# Altium schematic sheet PSU.SchDoc
size A3; SheetNumber: 5; SheetTotal: 6
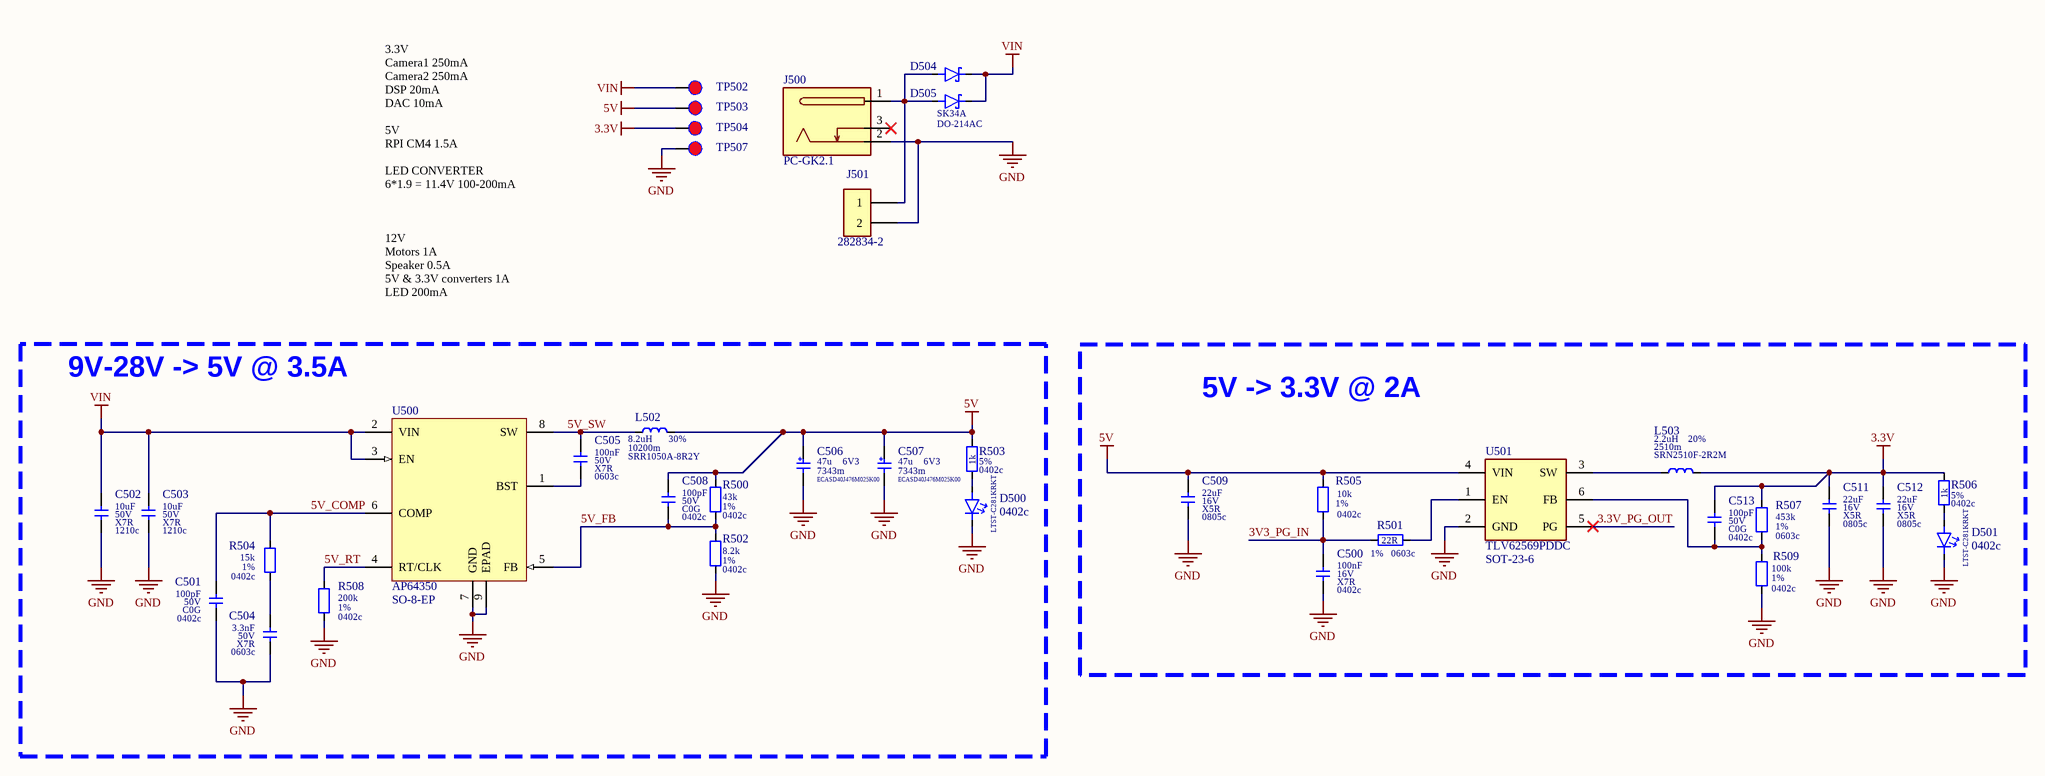
[diagram p0: PSU.SchDoc]

## Parts
C500  11 Parameter 4: X7R  07 Package: 0402c  08 Parameter 1: 100nF  09 Parameter 2: 16V  [CAPC1005X60L]  (hidden comment: CL05B104KO5NNNC)
C501  11 Parameter 4: C0G  07 Package: 0402c  08 Parameter 1: 100pF  09 Parameter 2: 50V  [CAPC1005X60L]  (hidden comment: GRM1555C1H101JA01D)
C502  11 Parameter 4: X7R  07 Package: 1210c  08 Parameter 1: 10uF  09 Parameter 2: 50V  [CAPC3225X270L]  (hidden comment: CL32B106KBJNNNE)
C503  11 Parameter 4: X7R  07 Package: 1210c  08 Parameter 1: 10uF  09 Parameter 2: 50V  [CAPC3225X270L]  (hidden comment: CL32B106KBJNNNE)
C504  11 Parameter 4: X7R  07 Package: 0603c  08 Parameter 1: 3.3nF  09 Parameter 2: 50V  [CAPC1608X90L]  (hidden comment: CL10B332KB8NNNC)
C505  11 Parameter 4: X7R  07 Package: 0603c  08 Parameter 1: 100nF  09 Parameter 2: 50V  [CAPC1608X90L]  (hidden comment: CL10B104KB8NNNC)
C506  09 Parameter 2: 6V3  08 Parameter 1: 47u  07 Package: 7343m  [CAPMP7343X20L]  (hidden comment: ECASD40J476M025K00)
C507  09 Parameter 2: 6V3  08 Parameter 1: 47u  07 Package: 7343m  [CAPMP7343X20L]  (hidden comment: ECASD40J476M025K00)
C508  11 Parameter 4: C0G  07 Package: 0402c  08 Parameter 1: 100pF  09 Parameter 2: 50V  [CAPC1005X60L]  (hidden comment: GRM1555C1H101JA01D)
C509  11 Parameter 4: X5R  07 Package: 0805c  08 Parameter 1: 22uF  09 Parameter 2: 16V  [CAPC2013X145L]  (hidden comment: CL21A226MOQNNNE)
C511  11 Parameter 4: X5R  07 Package: 0805c  08 Parameter 1: 22uF  09 Parameter 2: 16V  [CAPC2013X145L]  (hidden comment: CL21A226MOQNNNE)
C512  11 Parameter 4: X5R  07 Package: 0805c  08 Parameter 1: 22uF  09 Parameter 2: 16V  [CAPC2013X145L]  (hidden comment: CL21A226MOQNNNE)
C513  11 Parameter 4: C0G  07 Package: 0402c  08 Parameter 1: 100pF  09 Parameter 2: 50V  [CAPC1005X60L]  (hidden comment: GRM1555C1H101JA01D)
D500  07 Package: 0402c  [LEDSC100x50x35-2L]  (hidden comment: LTST-C281KRKT)
D501  07 Package: 0402c  [LEDSC100x50x35-2L]  (hidden comment: LTST-C281KRKT)
D504  SK34A  [DIOM4326X250L]  (value not drawn)
D505  07 Package: DO-214AC  [DIOM4326X250L]  (hidden comment: SK34A)
J500  PC-GK2.1  [NINIGI PC-GK2.1]
J501  282834-2  [TE 282834-2]
L502  09 Parameter 2: 30%  08 Parameter 1: 8.2uH  07 Package: 10200m  [IND102100X51L]  (hidden comment: SRR1050A-8R2Y)
L503  09 Parameter 2: 20%  08 Parameter 1: 2.2uH  07 Package: 2510m  [IND2510X10L]  (hidden comment: SRN2510F-2R2M)
R500  07 Package: 0402c  09 Parameter 2: 1%  08 Parameter 1: 43k  [RESC1005X40L]  (hidden comment: RC0402FR-0743KL)
R501  07 Package: 0603c  09 Parameter 2: 1%  08 Parameter 1: 22R  [RESC1608X55L]  (hidden comment: RC0603FR-0722RL)
R502  07 Package: 0402c  09 Parameter 2: 1%  08 Parameter 1: 8.2k  [RESC1005X40L]  (hidden comment: RC0402FR-078K2L)
R503  07 Package: 0402c  09 Parameter 2: 5%  08 Parameter 1: 1k  [RESC1005X40L]  (hidden comment: RC0402JR-071KL)
R504  07 Package: 0402c  09 Parameter 2: 1%  08 Parameter 1: 15k  [RESC1005X40L]  (hidden comment: RC0402FR-0715KL)
R505  07 Package: 0402c  09 Parameter 2: 1%  08 Parameter 1: 10k  [RESC1005X40L]  (hidden comment: RC0402FR-0710KL)
R506  07 Package: 0402c  09 Parameter 2: 5%  08 Parameter 1: 1k  [RESC1005X40L]  (hidden comment: RC0402JR-071KL)
R507  07 Package: 0603c  09 Parameter 2: 1%  08 Parameter 1: 453k  [RESC1608X55L]  (hidden comment: RC0603FR-07453KL)
R508  07 Package: 0402c  09 Parameter 2: 1%  08 Parameter 1: 200k  [RESC1005X40L]  (hidden comment: RC0402FR-07200KL)
R509  07 Package: 0402c  09 Parameter 2: 1%  08 Parameter 1: 100k  [RESC1005X40L]  (hidden comment: RC0402FR-07100KL)
TP502  TESTPAD  [TP 1.2mm]  (value not drawn)  (no BOM)
TP503  TESTPAD  [TP 1.2mm]  (value not drawn)  (no BOM)
TP504  TESTPAD  [TP 1.2mm]  (value not drawn)  (no BOM)
TP507  TESTPAD  [TP 1.2mm]  (value not drawn)  (no BOM)
U500  07 Package: SO-8-EP  [SOIC127P600X170_HS350x261-9L]  (hidden comment: AP64350)
U501  07 Package: SOT-23-6  [SOT95P280X110-6L]  (hidden comment: TLV62569PDDC)

## Blocks framed on the sheet
9V-28V -> 5V @ 3.5A: C501-C508 D500 L502 R500 R502-R504 R508 U500
5V -> 3.3V @ 2A: C500 C509 C511-C513 D501 L503 R501 R505-R507 R509 U501

## Nets
3.3V: C511.2 C512.2 C513.2 L503.2 R506.2 R507.2 TP504.1
5V: C506.1 C507.1 C508.2 C509.2 L502.2 R500.2 R503.2 R505.2 TP503.1 U501.4(VIN)
GND: C500.1 C501.1 C502.1 C503.1 C504.1 C506.2 C507.2 C509.1 C511.1 C512.1 D500.K D501.K J500.2 J501.2 R502.1 R508.1 R509.1 TP507.1 U500.7(GND) U500.9(EPAD) U501.2(GND)
VIN: C502.2 C503.2 D504.K D505.K TP502.1 U500.2(VIN) U500.3(EN)
3.3V_PG_OUT: U501.5(PG)
3V3_PG_IN: C500.2 R501.1 R505.1
5V_COMP: C501.2 R504.2 U500.6(COMP)
5V_FB: C508.1 R500.1 R502.2 U500.5(FB)
5V_RT: R508.2 U500.4(RT/CLK)
5V_SW: C505.2 L502.1 U500.8(SW)
NetC504_2: C504.2 R504.1
NetC505_1: C505.1 U500.1(BST)
NetC513_1: C513.1 R507.1 R509.2 U501.6(FB)
NetD500_A: D500.A R503.1
NetD501_A: D501.A R506.1
NetD504_A: D504.A D505.A J500.1 J501.1
NetL503_1: L503.1 U501.3(SW)
NetR501_2: R501.2 U501.1(EN)

Not connected (* = marked no-connect by the designer): J500 3*

## Notes on the sheet
- 3.3V
  Camera1 250mA
  Camera2 250mA
  DSP 20mA
  DAC 10mA
  5V
  RPI CM4 1.5A
  LED CONVERTER
  6*1.9 = 11.4V 100-200mA
  12V
  Motors 1A
  Speaker 0.5A
  5V & 3.3V converters 1A
  LED 200mA
- Version:
- SVN Rev:
- Sheet:
- File:
- Modification Date:
- Variant:
- of
- Sheet Size:
- A3
- SaraAI
- (in symbol 260) +

## Library data of the parts
C500 = 138: SMT 0402c 100nF 16V 10% X7R 25.8MHz 125'C; 03 Manufacturer: Samsung; 00 Index: 138; 01 Name: CAPACITOR CERAMIC CL05B104KO5NNNC Samsung; 05 Sub Group: CERAMIC; 04 Main Group: CAPACITOR; 06 Assembly: SMT; 12 Parameter 5: 25.8MHz; 13 Parameter 6: 125'C; 14 Modification Date: 16.11.2020; ComponentLink1Description: DATASHEET; ComponentLink1URL: E:\Praca\Mindsailors\Mindsailors Altium\Database Library\Datasheets\CAPACITOR\Samsung CL05B104KO5NNNC.pdf; 02 MPN: CL05B104KO5NNNC; 10 Parameter 3: 10%
C501 C508 C513 = 137: SMT 0402c 100pF 50V 5% C0G 814MHz 125'C; 03 Manufacturer: Murata; 00 Index: 137; 01 Name: CAPACITOR CERAMIC GRM1555C1H101JA01D Murata; 05 Sub Group: CERAMIC; 04 Main Group: CAPACITOR; 06 Assembly: SMT; 12 Parameter 5: 814MHz; 13 Parameter 6: 125'C; 14 Modification Date: 16.11.2020; ComponentLink1Description: DATASHEET; ComponentLink1URL: E:\Praca\Mindsailors\Mindsailors Altium\Database Library\Datasheets\CAPACITOR\Murata GRM1555C1H101JA01D.pdf; 02 MPN: GRM1555C1H101JA01D; 10 Parameter 3: 5%
C502 C503 = 259: SMT 1210c 10uF 50V 10% X7R 125°C; 03 Manufacturer: Samsung; 00 Index: 259; 01 Name: CAPACITOR CERAMIC CL32B106KBJNNNC Samsung; 05 Sub Group: CERAMIC; 04 Main Group: CAPACITOR; 06 Assembly: SMT; 13 Parameter 6: 125°C; 14 Modification Date: 25.01.2021; ComponentLink1Description: DATASHEET; ComponentLink1URL: http://weblib.samsungsem.com/mlcc/mlcc-ec-data-sheet.do?partNumber=CL32B106KBJNNN; 02 MPN: CL32B106KBJNNNE; 10 Parameter 3: 10%
C504 = 206: SMT 0603c 3.3nF 50V 10% X7R 125°C; 03 Manufacturer: Samsung; 00 Index: 206; 01 Name: CAPACITOR CERAMIC CL10B332KB8NNNC Samsung; 05 Sub Group: CERAMIC; Library Directory: sym_basics/; Fotprint Directory: fot_ipc/; 04 Main Group: CAPACITOR; 06 Assembly: SMT; 13 Parameter 6: 125°C; 14 Modification Date: 25.01.2021; ComponentLink1Description: DATASHEET; ComponentLink1URL: http://weblib.samsungsem.com/mlcc/mlcc-ec-data-sheet.do?partNumber=CL10B332KB8NNN; 02 MPN: CL10B332KB8NNNC; 10 Parameter 3: 10%
C505 = 164: SMT 0603c 100nF 50V 10% X7R 125'C; 03 Manufacturer: Samsung; 00 Index: 164; 01 Name: CAPACITOR CERAMIC CL10B104KB8NNNC Samsung; 05 Sub Group: CERAMIC; 04 Main Group: CAPACITOR; 06 Assembly: SMT; 13 Parameter 6: 125'C; 14 Modification Date: 21.12.2020; ComponentLink1Description: DATASHEET; ComponentLink1URL: E:\Praca\Mindsailors\Mindsailors Altium\Database Library\Datasheets\CAPACITOR\Samsung CL01B104KB8NNNC.pdf; 02 MPN: CL10B104KB8NNNC; 10 Parameter 3: 10%
C506 C507 = 260: SMT 7343m 47u 6V3 20% 25mOhm 1.8A 105°C; 03 Manufacturer: Murata; 00 Index: 260; 01 Name: CAPACITOR POLYMER ECASD40J476M025K00 Murata; 04 Main Group: CAPACITOR; 05 Sub Group: POLYMER; 06 Assembly: SMT; 11 Parameter 4: 25mOhm; 12 Parameter 5: 1.8A; 13 Parameter 6: 105°C; 14 Modification Date: 25.01.2021; ComponentLink1Description: DATASHEET; ComponentLink1URL: https://pl.mouser.com/datasheet/2/281/c90e-1501405.pdf; 10 Parameter 3: 20%; 02 MPN: ECASD40J476M025K00
C509 C511 C512 = 81: SMT 0805c 22uF 16V 20% X5R 1.6MHz 85'C; 03 Manufacturer: Samsung; 00 Index: 81; 01 Name: CAPACITOR CERAMIC CL21A226MOQNNNE Samsung; 05 Sub Group: CERAMIC; 04 Main Group: CAPACITOR; 06 Assembly: SMT; 12 Parameter 5: 1.6MHz; 13 Parameter 6: 85'C; 14 Modification Date: 16.11.2020; ComponentLink1Description: DATASHEET; ComponentLink1URL: E:\Praca\Mindsailors\Mindsailors Altium\Database Library\Datasheets\CAPACITOR\Samsung CL21A226MOQNNN.pdf; 02 MPN: CL21A226MOQNNNE; 10 Parameter 3: 20%
D500 D501 = 176: SMT 0402c RED Striaight 18...54mcd  130deg 2.0V; 03 Manufacturer: LITEON; 00 Index: 176; 01 Name: DIODE LED LTST-C281KRKT LITEON; 04 Main Group: DIODE; 05 Sub Group: LED; 06 Assembly: SMT; 11 Parameter 4: 18...54mcd; 12 Parameter 5: 130deg; 13 Parameter 6: 2.0V; 14 Modification Date: 21.01.2021; ComponentLink1Description: DATASHEET; ComponentLink1URL: E:\Praca\Mindsailors\Mindsailors Altium\Database Library\Datasheets\DIODE\LITEON LTST-C281KRKT.pdf; 08 Parameter 1: RED; 10 Parameter 3: Striaight; 02 MPN: LTST-C281KRKT
D504 D505 = 793: SMT DO-214AC 40V 3A 0.55V 70A 500uA; 03 Manufacturer: Taiwan Semiconductor; 00 Index: 793; 01 Name: DIODE SCHOTTKY SK34A Taiwan Semiconductor; 04 Main Group: DIODE; Library Directory: sym_basics/; Fotprint Directory: fot_ipc/; 05 Sub Group: SCHOTTKY; 06 Assembly: SMT; 11 Parameter 4: 70A; 12 Parameter 5: 500uA; 14 Modification Date: 29.11.2021; ComponentLink1Description: DATASHEET; ComponentLink1URL: https://datasheet.octopart.com/SK36A-R3G-Taiwan-Semiconductor-datasheet-94061880.pdf; 10 Parameter 3: 0.55V; 09 Parameter 2: 3A; 08 Parameter 1: 40V; 02 MPN: SK34A
  D504: 07 Package: DO-214AC
J500 = 515: THT DC BARREL JACK Right Angle; 03 Manufacturer: NINIGI; 00 Index: 515; 01 Name: CONNECTOR WIRE PC-GK2.1 NINIGI; 04 Main Group: CONNECTOR; 05 Sub Group: WIRE; Library Directory: sym_other/; Fotprint Directory: fot_other/; 06 Assembly: THT; 11 Parameter 4: Right Angle; 14 Modification Date: 29.03.2021; ComponentLink1Description: DATASHEET; ComponentLink1URL: https://www.tme.eu/pl/details/pc-gk2.1/zlacza-dc/ninigi/; 09 Parameter 2: DC BARREL JACK; 02 MPN: PC-GK2.1; 07 Package: *
J501 = 978: THT 1x2 2.54mm Straight 150V 10A; 03 Manufacturer: TE Connectivity; 00 Index: 978; 01 Name: CONNECTOR WIRE 282834-2 TE Connectivity; 04 Main Group: CONNECTOR; 05 Sub Group: WIRE; Library Directory: sym_basics/; Fotprint Directory: fot_ipc/; 06 Assembly: THT; 13 Parameter 6: 10A; 14 Modification Date: 03.01.2022; ComponentLink1Description: DATASHEET; ComponentLink1URL: https://www.te.com/usa-en/product-282834-2.html; 09 Parameter 2: 2.54mm; 08 Parameter 1: 1x2; 11 Parameter 4: Straight; 12 Parameter 5: 150V; 07 Package: *; 02 MPN: 282834-2
L502 = 457: SMT 10200m 8.2uH 0,3 5A 4.85A 22mOhm 21MHz; 03 Manufacturer: Bourns; 01 Name: INDUCTOR WIREWOUND SRR1050A-8R2Y  Bourns; 05 Sub Group: WIREWOUND; 00 Index: 457; 04 Main Group: INDUCTOR; 06 Assembly: SMT; 12 Parameter 5: 22mOhm; 13 Parameter 6: 21MHz; 14 Modification Date: 14.02.2021; ComponentLink1Description: DATASHEET; ComponentLink1URL: https://pl.mouser.com/datasheet/2/54/srr1050a-1391598.pdf; 11 Parameter 4: 4.85A; 10 Parameter 3: 5A; 02 MPN: SRR1050A-8R2Y
L503 = 456: SMT 2510m 2.2uH 0,2 2.6A 2.8A 78mOhm 40MHz; 03 Manufacturer: Bourns; 01 Name: INDUCTOR WIREWOUND SRN2510F-2R2M Bourns; 05 Sub Group: WIREWOUND; 00 Index: 456; 04 Main Group: INDUCTOR; 06 Assembly: SMT; 12 Parameter 5: 78mOhm; 13 Parameter 6: 40MHz; 14 Modification Date: 14.02.2021; ComponentLink1Description: DATASHEET; ComponentLink1URL: http://www.farnell.com/datasheets/2644240.pdf; 11 Parameter 4: 2.8A; 10 Parameter 3: 2.6A; 02 MPN: SRN2510F-2R2M
R500 = 655: SMT 0402c 43k 1% 62.5mW 100ppm/K 50V; 03 Manufacturer: Yageo; 00 Index: 655; 01 Name: RESISTOR THICK FILM RC0402FR-0743KL Yageo; 05 Sub Group: THICK FILM; Library Directory: sym_basics/; Fotprint Directory: fot_ipc/; 04 Main Group: RESISTOR; 06 Assembly: SMT; 11 Parameter 4: 100ppm/K; 12 Parameter 5: 50V; 14 Modification Date: 10.05.2021; ComponentLink1Description: DATASHEET; ComponentLink1URL: https://www.yageo.com/upload/media/product/products/datasheet/rchip/PYu-RC_Group_51_RoHS_L_11.pdf; 10 Parameter 3: 62.5mW; 02 MPN: RC0402FR-0743KL
R501 = 318: SMT 0603c 22R 1% 100mW 100ppm/K 75V; 03 Manufacturer: Yageo; 00 Index: 318; 01 Name: RESISTOR THICK FILM RC0603FR-0722RL Yageo; 05 Sub Group: THICK FILM; Library Directory: sym_basics/; Fotprint Directory: fot_ipc/; 04 Main Group: RESISTOR; 06 Assembly: SMT; 11 Parameter 4: 100ppm/K; 12 Parameter 5: 75V; 14 Modification Date: 25.01.2021; ComponentLink1Description: DATASHEET; ComponentLink1URL: https://www.yageo.com/upload/media/product/products/datasheet/rchip/PYu-RC_Group_51_RoHS_L_11.pdf; 10 Parameter 3: 100mW; 02 MPN: RC0603FR-0722RL
R502 = 705: SMT 0402c 8.2k 1% 62.5mW 100ppm/K 50V; 03 Manufacturer: Yageo; 00 Index: 705; 01 Name: RESISTOR THICK FILM RC0402FR-078K2L Yageo; 05 Sub Group: THICK FILM; Library Directory: sym_basics/; Fotprint Directory: fot_ipc/; 04 Main Group: RESISTOR; 06 Assembly: SMT; 11 Parameter 4: 100ppm/K; 12 Parameter 5: 50V; 14 Modification Date: 10.05.2021; ComponentLink1Description: DATASHEET; ComponentLink1URL: https://www.yageo.com/upload/media/product/products/datasheet/rchip/PYu-RC_Group_51_RoHS_L_11.pdf; 10 Parameter 3: 62.5mW; 02 MPN: RC0402FR-078K2L
R503 R506 = 131: SMT 0402c 1k 5% 62.5mW 200ppm/K 50V; 03 Manufacturer: Yageo; 00 Index: 131; 01 Name: RESISTOR THICK FILM RC0402JR-071KL Yageo; 05 Sub Group: THICK FILM; 04 Main Group: RESISTOR; 06 Assembly: SMT; 11 Parameter 4: 200ppm/K; 12 Parameter 5: 50V; 14 Modification Date: 16.11.2020; ComponentLink1Description: DATASHEET; ComponentLink1URL: E:\Praca\Mindsailors\Mindsailors Altium\Database Library\Datasheets\RESISTOR\Yageo RC_L Series.pdf; 10 Parameter 3: 62.5mW; 02 MPN: RC0402JR-071KL
R504 = 572: SMT 0402c 15k 1% 62.5mW 100ppm/K 50V; 03 Manufacturer: Yageo; 00 Index: 572; 01 Name: RESISTOR THICK FILM RC0402FR-0715KL Yageo; 05 Sub Group: THICK FILM; Library Directory: sym_basics/; Fotprint Directory: fot_ipc/; 04 Main Group: RESISTOR; 06 Assembly: SMT; 11 Parameter 4: 100ppm/K; 12 Parameter 5: 50V; 14 Modification Date: 10.05.2021; ComponentLink1Description: DATASHEET; ComponentLink1URL: https://www.yageo.com/upload/media/product/products/datasheet/rchip/PYu-RC_Group_51_RoHS_L_11.pdf; 10 Parameter 3: 62.5mW; 02 MPN: RC0402FR-0715KL
R505 = 15: SMT 0402c 10k 1% 62.5mW 100ppm/K 50V; 03 Manufacturer: Yageo; 00 Index: 15; 01 Name: RESISTOR THICK FILM RC0402FR-0710KL Yageo; 05 Sub Group: THICK FILM; 04 Main Group: RESISTOR; 06 Assembly: SMT; 11 Parameter 4: 100ppm/K; 12 Parameter 5: 50V; 14 Modification Date: 16.11.2020; ComponentLink1Description: DATASHEET; ComponentLink1URL: E:\Praca\Mindsailors\Mindsailors Altium\Database Library\Datasheets\RESISTOR\Yageo RC_L Series.pdf; 10 Parameter 3: 62.5mW; 02 MPN: RC0402FR-0710KL
R507 = 373: SMT 0603c 453k 1% 100mW 100ppm/K 75V; 03 Manufacturer: Yageo; 00 Index: 373; 01 Name: RESISTOR THICK FILM RC0603FR-07453KL Yageo; 05 Sub Group: THICK FILM; 04 Main Group: RESISTOR; 06 Assembly: SMT; 11 Parameter 4: 100ppm/K; 12 Parameter 5: 75V; 14 Modification Date: 25.01.2021; ComponentLink1Description: DATASHEET; ComponentLink1URL: https://www.yageo.com/upload/media/product/products/datasheet/rchip/PYu-RC_Group_51_RoHS_L_11.pdf; 10 Parameter 3: 100mW; 02 MPN: RC0603FR-07453KL
R508 = 600: SMT 0402c 200k 1% 62.5mW 100ppm/K 50V; 03 Manufacturer: Yageo; 00 Index: 600; 01 Name: RESISTOR THICK FILM RC0402FR-07200KL Yageo; 05 Sub Group: THICK FILM; Library Directory: sym_basics/; Fotprint Directory: fot_ipc/; 04 Main Group: RESISTOR; 06 Assembly: SMT; 11 Parameter 4: 100ppm/K; 12 Parameter 5: 50V; 14 Modification Date: 10.05.2021; ComponentLink1Description: DATASHEET; ComponentLink1URL: https://www.yageo.com/upload/media/product/products/datasheet/rchip/PYu-RC_Group_51_RoHS_L_11.pdf; 10 Parameter 3: 62.5mW; 02 MPN: RC0402FR-07200KL
R509 = 18: SMT 0402c 100k 1% 62.5mW 100ppm/K 50V; 03 Manufacturer: Yageo; 00 Index: 18; 01 Name: RESISTOR THICK FILM RC0402FR-07100KL Yageo; 05 Sub Group: THICK FILM; 04 Main Group: RESISTOR; 06 Assembly: SMT; 11 Parameter 4: 100ppm/K; 12 Parameter 5: 50V; 14 Modification Date: 16.11.2020; ComponentLink1Description: DATASHEET; ComponentLink1URL: E:\Praca\Mindsailors\Mindsailors Altium\Database Library\Datasheets\RESISTOR\Yageo RC_L Series.pdf; 10 Parameter 3: 62.5mW; 02 MPN: RC0402FR-07100KL
TP502-TP504 TP507 = 10: 00 Index: 10; 01 Name: PCB COMPONENT TESTPAD TESTPAD; 04 Main Group: PCB COMPONENT; 02 MPN: TESTPAD; 05 Sub Group: TESTPAD; 14 Modification Date: 16.11.2020
U500 = 986: SMT SO-8-EP 40V 3.5A 100kHz - 2.2MHz; 03 Manufacturer: Diodes; 00 Index: 986; 01 Name: IC DCDC CONVERTER AP64350 Diodes; 04 Main Group: IC; 05 Sub Group: DCDC CONVERTER; 16 Replacements: AP64500SP-13; Library Directory: sym_other/; Fotprint Directory: fot_ipc/; 06 Assembly: SMT; 11 Parameter 4: 40V; 12 Parameter 5: 3.5A; 13 Parameter 6: 100kHz - 2.2MHz; 14 Modification Date: 14.02.2022; ComponentLink1Description: DATASHEET; ComponentLink1URL: https://www.diodes.com/assets/Datasheets/AP64350.pdf; 02 MPN: AP64350
U501 = 459: SMT SOT-23-6 5.5V 2A 1.5MHz; 03 Manufacturer: Texas Instruments; 00 Index: 459; 01 Name: IC DCDC CONVERTER TLV62569PDDC Texas Instruments; 04 Main Group: IC; 05 Sub Group: DCDC CONVERTER; 06 Assembly: SMT; 11 Parameter 4: 5.5V; 12 Parameter 5: 2A; 13 Parameter 6: 1.5MHz; 14 Modification Date: 14.02.2021; ComponentLink1Description: DATASHEET; ComponentLink1URL: https://www.ti.com/lit/ds/symlink/tlv62569.pdf?ts=1613311991034&ref_url=https%253A%252F%252Fwww.google.com%252F; 02 MPN: TLV62569PDDC